# EAGLE design MBC5_1-3 (EAGLE 9.6.2)
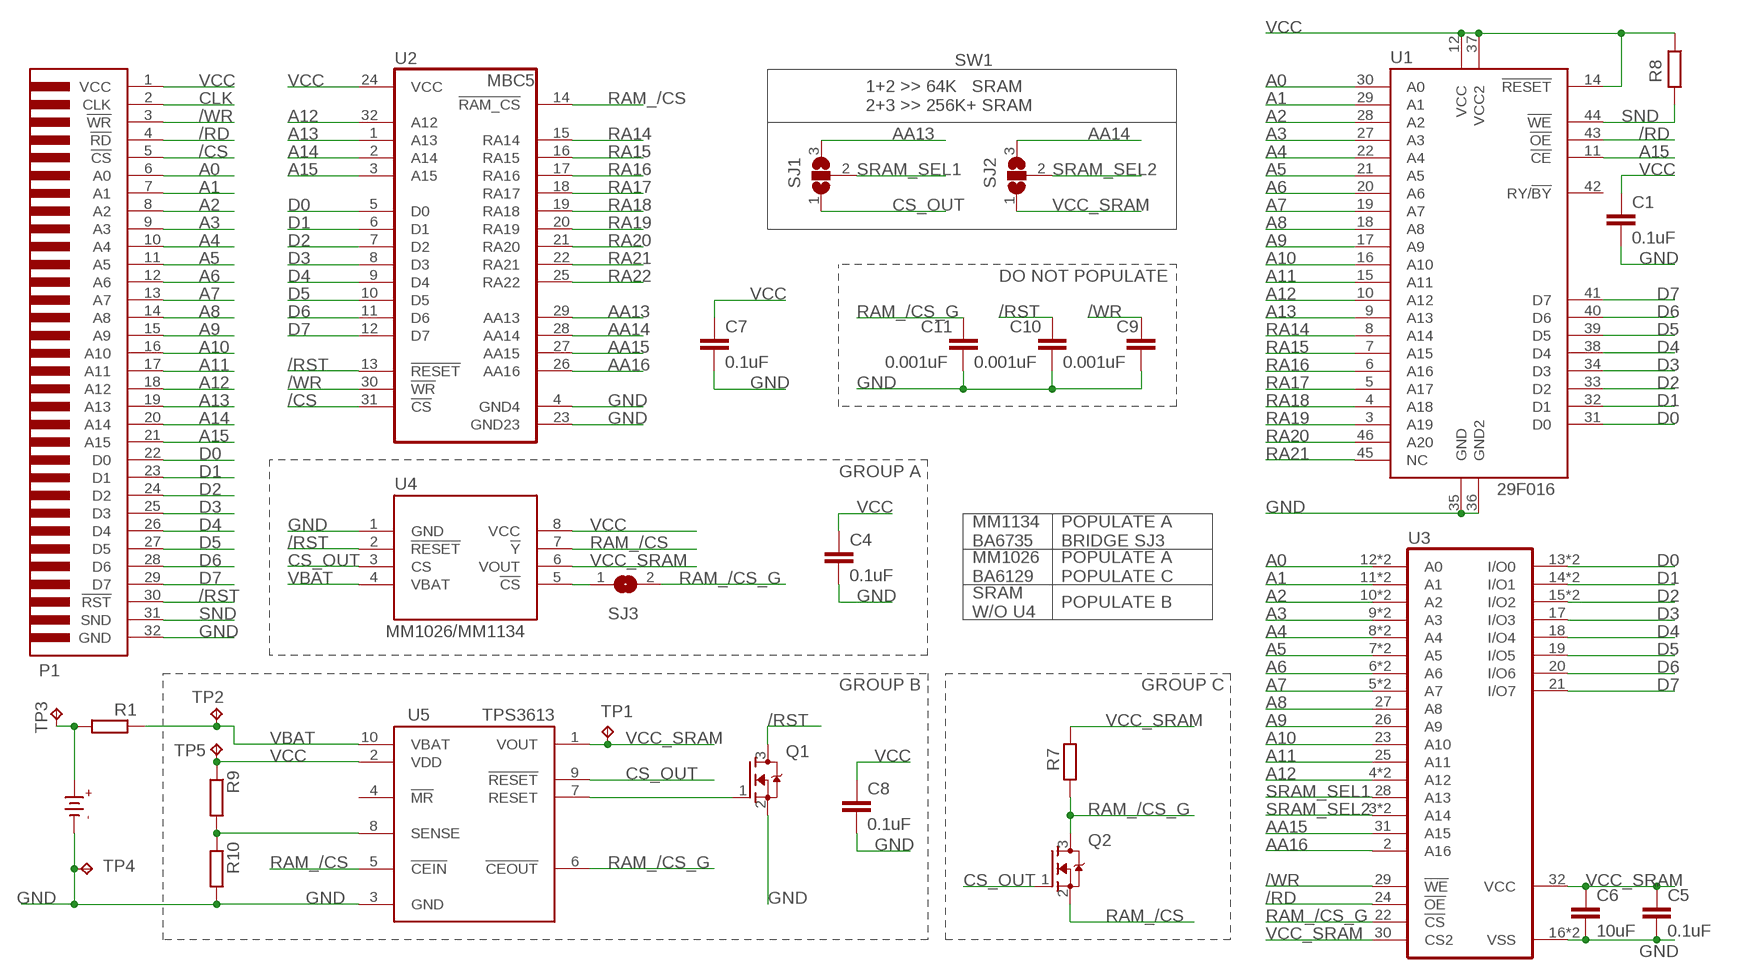
[diagram p0: schematic, sheet 1]

## Parts
B1  CR2025  [CR2025]
C1  0.1uF  C-EUC0603  [C0603]
C4  0.1uF  C-EUC0603  [C0603]
C5  0.1uF  C-EUC0603  [C0603]
C6  10uF  C-EUC0603  [C0603]
C7  0.1uF  C-EUC0603  [C0603]
C8  0.1uF  C-EUC0603  [C0603]
C9  0.001uF  C-EUC0603  [C0603]
C10  0.001uF  C-EUC0603  [C0603]
C11  0.001uF  C-EUC0603  [C0603]
P1  GBC_CART  [GBC_CART]
Q1  2N7002  MOSFET-NREFLOW  [SOT23]
Q2  2N7002  MOSFET-NREFLOW  [SOT23]
R1  RR0603  [R0603]
R7  RR0603  [R0603]
R8  RR0603  [R0603]
R9  RR0603  [R0603]
R10  RR0603  [R0603]
SJ1  SJ2W  [SJ_2]
SJ2  SJ2W  [SJ_2]
SJ3  SJ  [SJ]
TP1  TPB1,27  [B1,27]
TP2  TPB1,27  [B1,27]
TP3  TPB1,27  [B1,27]
TP4  TPB1,27  [B1,27]
TP5  TPB1,27  [B1,27]
U1  29F016  [TSOP-48]
U2  MBC5  [QFP-32]
U3  1008L  [SO32L_L]
U4  MM1134  [SOIC-8]
U5  TPS3613  [MSOP-10]

## Nets
/CS: P1.5(!CS) U2.31(!CS)
/RD: P1.4(!RD) U1.43(!OE) U3.24(!OE)
/RST: C10.1 P1.30(!RST) Q1.3(D) U2.13(!RESET) U4.2(!RESET)
/WR: C9.1 P1.3(!WR) U2.30(!WR) U3.29(!WE)
A0: P1.6(A0) U1.30(A0) U3.12(A0) U3.L12(A0)
A1: P1.7(A1) U1.29(A1) U3.11(A1) U3.L11(A1)
A2: P1.8(A2) U1.28(A2) U3.10(A2) U3.L10(A2)
A3: P1.9(A3) U1.27(A3) U3.9(A3) U3.L9(A3)
A4: P1.10(A4) U1.22(A4) U3.8(A4) U3.L8(A4)
A5: P1.11(A5) U1.21(A5) U3.7(A5) U3.L7(A5)
A6: P1.12(A6) U1.20(A6) U3.6(A6) U3.L6(A6)
A7: P1.13(A7) U1.19(A7) U3.5(A7) U3.L5(A7)
A8: P1.14(A8) U1.18(A8) U3.27(A8)
A9: P1.15(A9) U1.17(A9) U3.26(A9)
A10: P1.16(A10) U1.16(A10) U3.23(A10)
A11: P1.17(A11) U1.15(A11) U3.25(A11)
A12: P1.18(A12) U1.10(A12) U2.32(A12) U3.4(A12) U3.L4(A12)
A13: P1.19(A13) U1.9(A13) U2.1(A13)
A14: P1.20(A14) U2.2(A14)
A15: P1.21(A15) U1.11(!CE) U2.3(A15)
AA13: SJ1.3 U2.29(AA13)
AA14: SJ2.3 U2.28(AA14)
AA15: U2.27(AA15) U3.31(A15)
AA16: U2.26(AA16) U3.2(A16)
CLK: P1.2(CLK)
CS_OUT: Q2.1(G) SJ1.1 U4.3(CS) U5.9(!RESET)
D0: P1.22(D0) U1.31(D0) U2.5(D0) U3.13(I/O0) U3.L13(I/O0)
D1: P1.23(D1) U1.32(D1) U2.6(D1) U3.14(I/O1) U3.L14(I/O1)
D2: P1.24(D2) U1.33(D2) U2.7(D2) U3.15(I/O2) U3.L15(I/O2)
D3: P1.25(D3) U1.34(D3) U2.8(D3) U3.17(I/O3)
D4: P1.26(D4) U1.38(D4) U2.9(D4) U3.18(I/O4)
D5: P1.27(D5) U1.39(D5) U2.10(D5) U3.19(I/O5)
D6: P1.28(D6) U1.40(D6) U2.11(D6) U3.20(I/O6)
D7: P1.29(D7) U1.41(D7) U2.12(D7) U3.21(I/O7)
GND [GND]: B1.- C1.2 C4.2 C5.2 C6.2 C7.2 C8.2 C9.2 C10.2 C11.2 P1.32(GND) Q1.2(S) R10.2 TP4.TP U1.35(GND) U1.36(GND2) U2.4(GND4) U2.23(GND23) U3.16(VSS) U3.L16(VSS) U4.1(GND) U5.3(GND)
N$3 [VCC]: B1.+ R1.2 TP3.TP
N$4: SJ3.1 U4.5(!CS)
N$6: Q1.1(G) U5.7(RESET)
N$7: R9.2 R10.1 U5.8(SENSE)
RA14: U1.8(A14) U2.15(RA14)
RA15: U1.7(A15) U2.16(RA15)
RA16: U1.6(A16) U2.17(RA16)
RA17: U1.5(A17) U2.18(RA17)
RA18: U1.4(A18) U2.19(RA18)
RA19: U1.3(A19) U2.20(RA19)
RA20: U1.46(A20) U2.21(RA20)
RA21: U1.45(NC) U2.22(RA21)
RA22: U2.25(RA22)
RAM_/CS: Q2.2(S) U2.14(!RAM_CS) U4.7(!Y) U5.5(!CEIN)
RAM_/CS_G: C11.1 Q2.3(D) R7.1 SJ3.2 U3.22(!CS) U5.6(!CEOUT)
SND: P1.31(SND) R8.2 U1.44(!WE)
SRAM_SEL1: SJ1.2 U3.28(A13)
SRAM_SEL2: SJ2.2 U3.3(A14) U3.L3(A14)
VBAT [VCC]: R1.1 TP2.TP U4.4(VBAT) U5.10(VBAT)
VCC [VCC]: C1.1 C4.1 C7.1 C8.1 P1.1(VCC) R8.1 R9.1 TP5.TP U1.12(VCC) U1.14(!RESET) U1.37(VCC2) U2.24(VCC) U4.8(VCC) U5.2(VDD)
VCC_SRAM [VCC]: C5.1 C6.1 R7.2 SJ2.1 TP1.TP U3.30(CS2) U3.32(VCC) U4.6(VOUT) U5.1(VOUT)
Unconnected: U1.42(RY/!BY) U5.4(!MR)

## Notes on the sheet
- SW1
- 1+2 >> 64K   SRAM
  2+3 >> 256K+ SRAM
- DO NOT POPULATE
- GROUP A
- MM1134
  BA6735
- POPULATE A
  BRIDGE SJ3
- MM1026
  BA6129
- POPULATE A
  POPULATE C
- SRAM
  W/O U4
- POPULATE B
- MM1026/MM1134
- GROUP B | GROUP C

## Library data of the parts
B1 = gameboylib:CR2025
C1 C4-C11 = rcl:C-EU: CAPACITOR, European symbol; SPICEPREFIX: C
P1 = gameboylib:GBC_CART
Q1 Q2 = adafruit:MOSFET-N: N-Channel Mosfet 2N7002E - 60V 260mA SOT23 [Digikey: 2N7002ET1GOSTR-ND] - REEL BSH103 - 30V 850mA SOT23 [Digikey: 568-5013-1-ND]
R1 R7-R10 = eagle-ltspice:R: RESISTOR, European symbol; SPICEMODEL: NONE; SPICEPREFIX: R
SJ1 SJ2 = jumper:SJ2W: SMD solder JUMPER
SJ3 = jumper:SJ: SMD solder JUMPER
TP1-TP5 = testpad:TP: Test pad
U1 = gameboylib:29F016
U2 = gameboylib:MBC5: MBC5; OC_FARNELL: unknown; OC_NEWARK: unknown
U3 = gameboylib:1008L: MEMORY
U4 = gameboylib:MM1134
U5 = gameboylib:TPS3613

## Net classes
1 VCC: width 0.203 mm
2 GND: width 0.203 mm

## Board
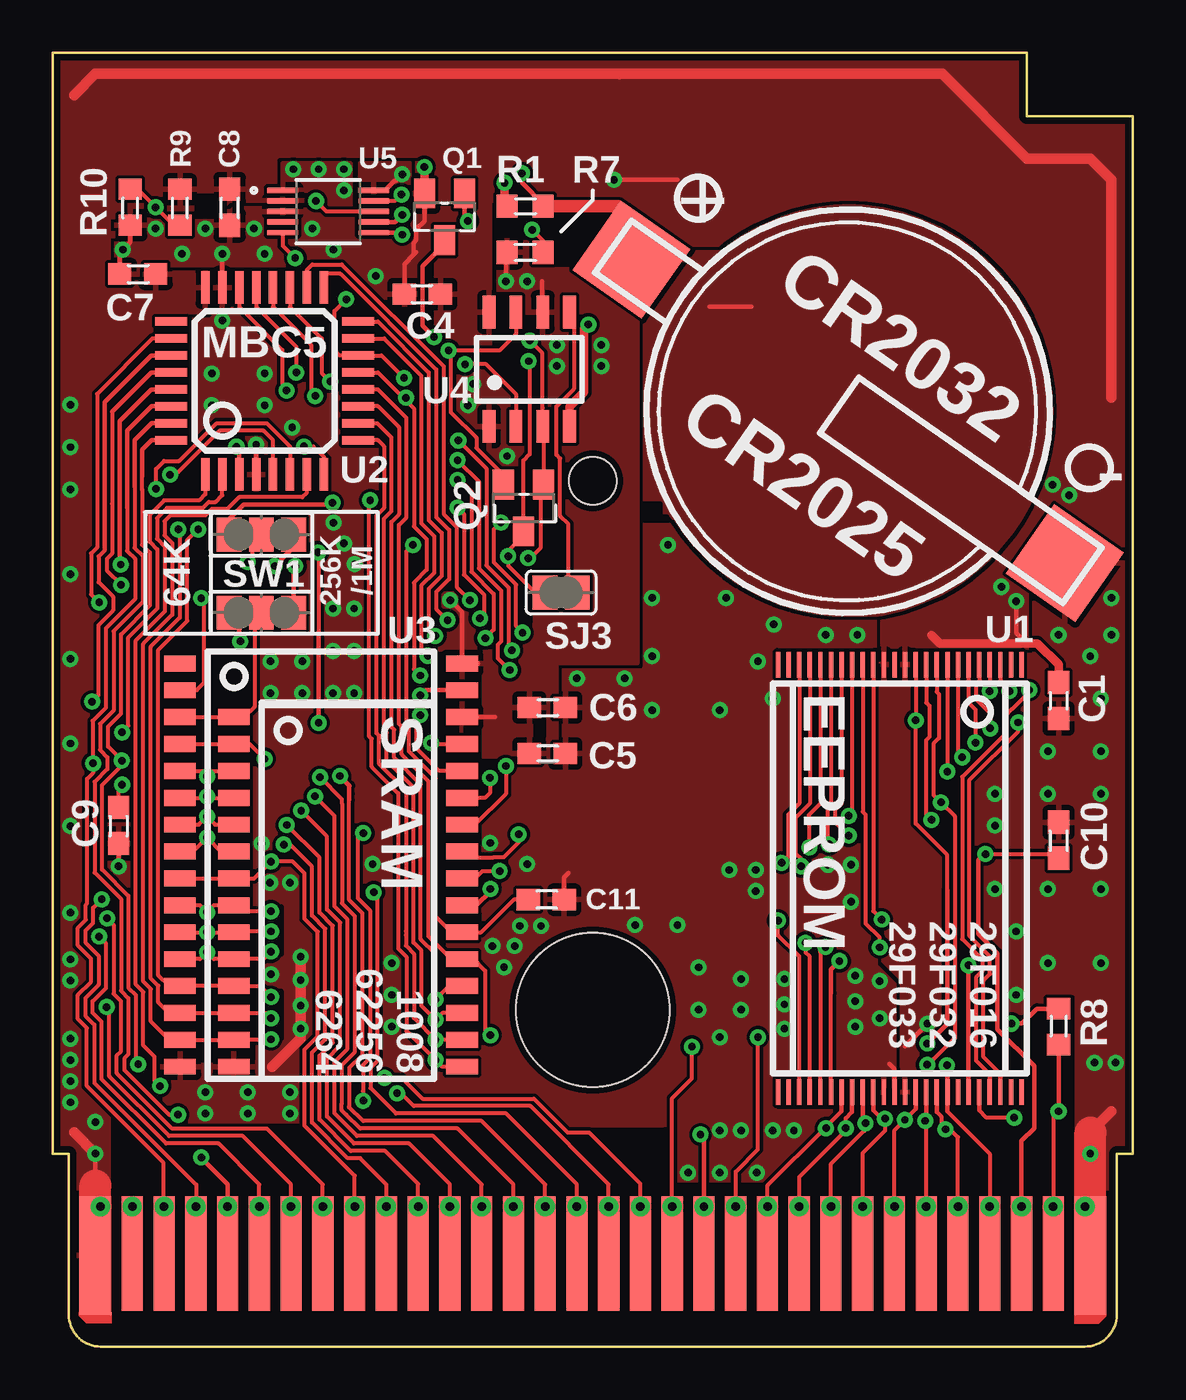
[diagram p1: board, top side]
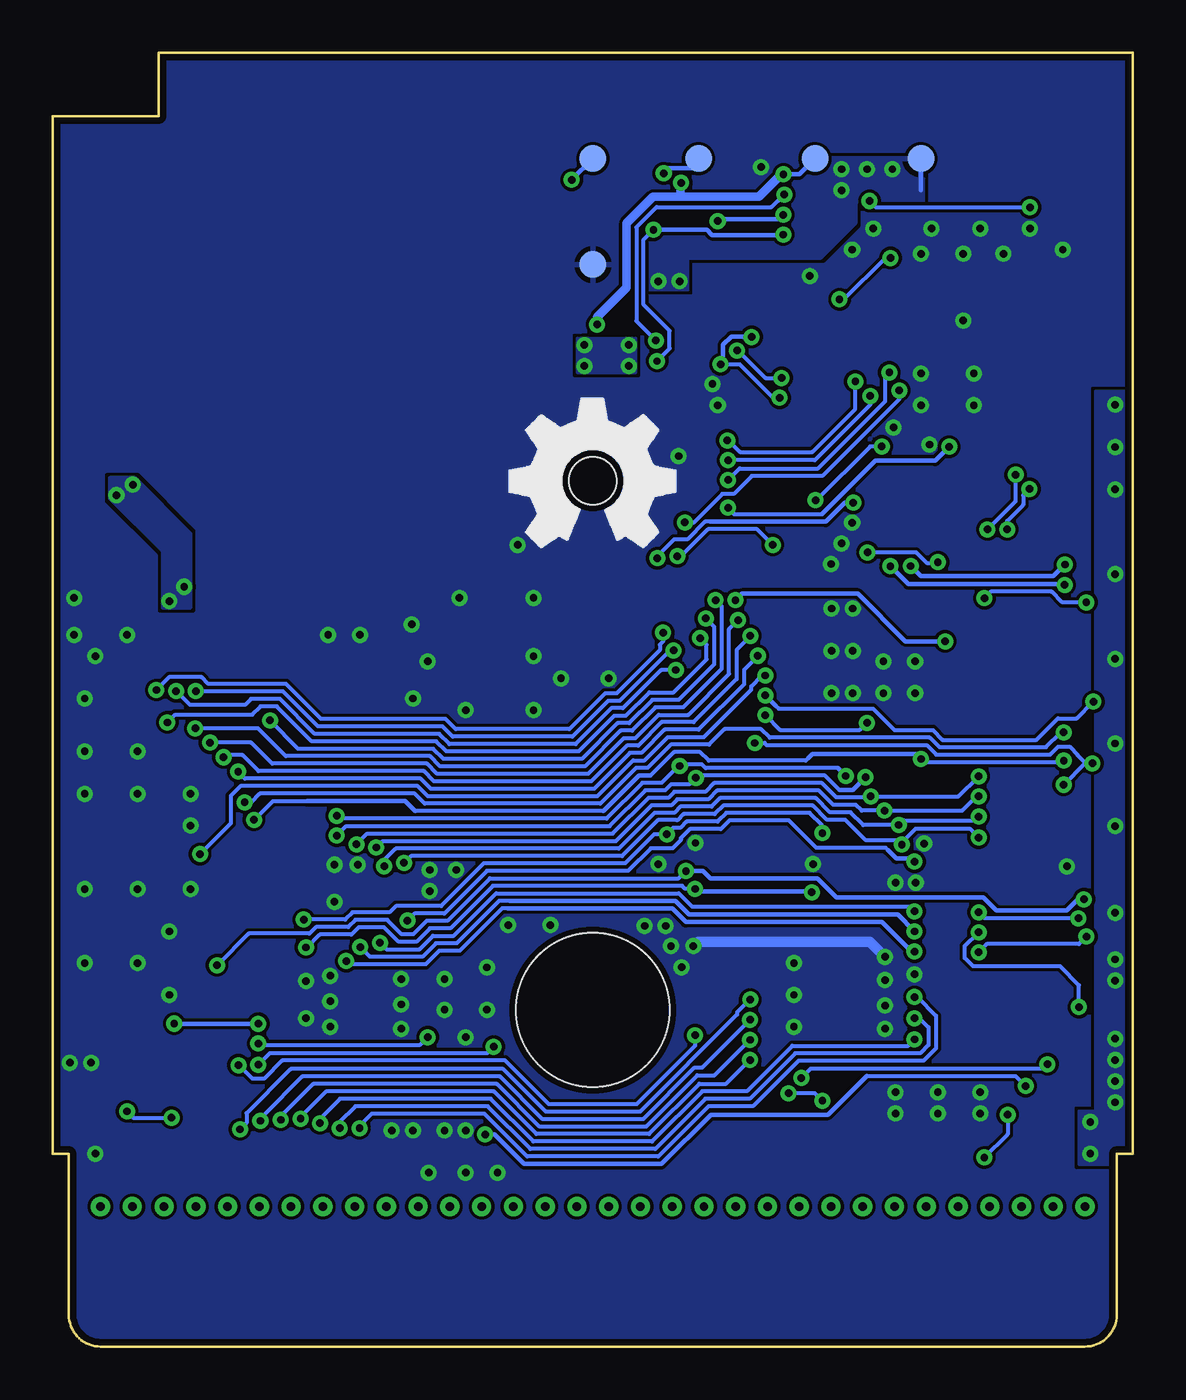
[diagram p2: board, bottom side, seen from below]

Size 51 x 61.1 mm. Coordinates in mm from the lower left corner, seen from the top.
Copper layers (1*16): Top 0.035mm / dielectric 1.5mm / Bottom 0.035mm
Design rules "default *": minimum track width 7mil, minimum drill 13mil, track to track 6mil, track to pad 7mil, pad to pad 7mil, via to via 7mil, smd to smd 5mil, copper to edge 12mil, drill to drill 22mil, minimum pad ring 10mil, minimum via ring 8mil, stop-mask expansion 4mil, vias tented up to drill 14mil, thermal gap 10mil
tKeepout: area -1.8,-1.5 to 54,11.6; area -1,11.1 to 2,62.1; area 49,11.1 to 52,62.1; area 2,55.2 to 49,62.1
tRestrict: area 28,6.8 to 33.9,7.7; area 2.9,3.6 to 48.1,7.7; area 10.2,14.5 to 10.8,16.8; area 34.1,12 to 39,12.7; area 34.2,32.6 to 38.8,32.9; area 46.6,0.8 to 49.9,1.3; area 40.7,32.6 to 45.8,32.9; area 8.3,50.5 to 11.7,50.9; area 6,43 to 6.5,48.5; area 8.9,21.1 to 9.3,29.5; area 9.1,13.6 to 9.4,14.3; area 7,13.5 to 7.6,13.9; area 18.4,29.1 to 18.9,32.6; area 19.8,30.3 to 20.1,31.9; area 19.5,23.7 to 20.1,29.3; area 19.8,19.9 to 20.1,20.5; area 21,49.3 to 22.1,49.7; area 34.2,11.3 to 43,11.8; area 47.5,4.7 to 48.1,16.5; area 27.9,39 to 29.1,39.8; area 2.9,7.1 to 3.5,11.2; area 25.1,9.8 to 28.9,10.3; area 23.6,51.1 to 24.7,51.5; area 21.8,48.2 to 22.9,48.6; area 10.2,10 to 11.8,10.4; area 10.2,18.5 to 10.8,20.8; area 9,17.3 to 9.6,18; area 21.2,52.5 to 21.6,52.9; area 6.8,53.4 to 7.6,54.4; area 16.4,48.6 to 16.9,49; area 22.1,34.2 to 22.6,34.6; area 22.8,28.8 to 23.2,29.5; area 15.9,54.5 to 16.1,54.6; area 39.5,11.9 to 39.5,12.2

### Footprints (pad centres in the part's own frame; a part is rotated, then mirrored left to right if it is on the bottom)
CR2025 = smd 4 x 4: + -12,0; - 13,0
C0603 = smd 1.1 x 1: 1 -0.85,0; 2 0.85,0
GBC_CART = smd 1.5 x 5.6: 1 -23.4,-25.01; 32 23.6,-25.01 | smd 1 x 5.4: 2 -21.65,-24.91; 3 -20.15,-24.91; 4 -18.65,-24.91; 5 -17.15,-24.91; 6 -15.65,-24.91; 7 -14.15,-24.91; 8 -12.65,-24.91; 9 -11.15,-24.91; 10 -9.65,-24.91; 11 -8.15,-24.91; 12 -6.65,-24.91; 13 -5.15,-24.91; 14 -3.65,-24.91; 15 -2.15,-24.91; 16 -0.65,-24.91; 17 0.85,-24.91; 18 2.35,-24.91; 19 3.85,-24.91; 20 5.35,-24.91; 21 6.85,-24.91; 22 8.35,-24.91; 23 9.85,-24.91; 24 11.35,-24.91; 25 12.85,-24.91; 26 14.35,-24.91; 27 15.85,-24.91; 28 17.35,-24.91; 29 18.85,-24.91; 30 20.35,-24.91; 31 21.85,-24.91 | drill 0.4: P$1 -21.65,-22.7; P$2 -18.65,-22.7; P$3 -15.65,-22.7; P$4 -12.65,-22.7; P$5 -9.65,-22.7; P$6 -6.65,-22.7; P$7 -3.65,-22.7; P$8 -0.65,-22.7; P$9 2.35,-22.7; P$10 5.35,-22.7; P$11 8.35,-22.7; P$12 11.35,-22.7; P$13 14.35,-22.7; P$14 17.35,-22.7; P$15 20.35,-22.7; P$16 23.35,-22.7; P$17 21.85,-22.7; P$18 18.85,-22.7; P$19 15.85,-22.7; P$20 12.85,-22.7; P$21 9.85,-22.7; P$22 6.85,-22.7; P$23 3.85,-22.7; P$24 0.85,-22.7; P$25 -2.15,-22.7; P$26 -5.15,-22.7; P$27 -8.15,-22.7; P$28 -11.15,-22.7; P$29 -14.15,-22.7; P$30 -17.15,-22.7; P$31 -20.15,-22.7; P$32 -23.15,-22.7 | hole 7.25: 0.1,-13.41 | hole 2.25: 0.1,11.585
SOT23 = smd 1 x 1.4: 1 -0.95,-1.1; 2 0.95,-1.1; 3 0,1.1
R0603 = smd 1 x 1.1: 1 -0.85,0; 2 0.85,0
SJ_2 = smd 1.168 x 1.6: 1 -1.524,0; 2 0,0; 3 1.524,0
SJ = smd 1.168 x 1.6: 1 -0.762,0; 2 0.762,0
B1,27 = smd 1.27 x 1.27: TP 0,0
TSOP-48 = smd 1.2 x 0.21: 1 -10.1,5.75; 2 -10.1,5.25; 3 -10.1,4.75; 4 -10.1,4.25; 5 -10.1,3.75; 6 -10.1,3.25; 7 -10.1,2.75; 8 -10.1,2.25; 9 -10.1,1.75; 10 -10.1,1.25; 11 -10.1,0.75; 12 -10.1,0.25; 13 -10.1,-0.25; 14 -10.1,-0.75; 15 -10.1,-1.25; 16 -10.1,-1.75; 17 -10.1,-2.25; 18 -10.1,-2.75; 19 -10.1,-3.25; 20 -10.1,-3.75; 21 -10.1,-4.25; 22 -10.1,-4.75; 23 -10.1,-5.25; 24 -10.1,-5.75; 25 10.1,-5.75; 26 10.1,-5.25; 27 10.1,-4.75; 28 10.1,-4.25; 29 10.1,-3.75; 30 10.1,-3.25; 31 10.1,-2.75; 32 10.1,-2.25; 33 10.1,-1.75; 34 10.1,-1.25; 35 10.1,-0.75; 36 10.1,-0.25; 37 10.1,0.25; 38 10.1,0.75; 39 10.1,1.25; 40 10.1,1.75; 41 10.1,2.25; 42 10.1,2.75; 43 10.1,3.25; 44 10.1,3.75; 45 10.1,4.25; 46 10.1,4.75; 47 10.1,5.25; 48 10.1,5.75
QFP-32 = smd 0.4 x 1.524: 1 -2.8,-4.415; 2 -2,-4.415; 3 -1.2,-4.415; 4 -0.4,-4.415; 5 0.4,-4.415; 6 1.2,-4.415; 7 2,-4.415; 8 2.8,-4.415; 17 2.8,4.415; 18 2,4.415; 19 1.2,4.415; 20 0.4,4.415; 21 -0.4,4.415; 22 -1.2,4.415; 23 -2,4.415; 24 -2.8,4.415 | smd 1.524 x 0.4: 9 4.415,-2.8; 10 4.415,-2; 11 4.415,-1.2; 12 4.415,-0.4; 13 4.415,0.4; 14 4.415,1.2; 15 4.415,2; 16 4.415,2.8; 25 -4.415,2.8; 26 -4.415,2; 27 -4.415,1.2; 28 -4.415,0.4; 29 -4.415,-0.4; 30 -4.415,-1.2; 31 -4.415,-2; 32 -4.415,-2.8
SO32L_L = smd 0.75 x 1.5: 1 -10.16,-7.997; 2 -8.89,-7.997; 3 -7.62,-5.457; 4 -6.35,-5.457; 5 -5.08,-5.457; 6 -3.81,-5.457; 7 -2.54,-5.457; 8 -1.27,-5.457; 9 0,-5.457; 10 1.27,-5.457; 11 2.54,-5.457; 12 3.81,-5.457; 13 5.08,-5.457; 14 6.35,-5.457; 15 7.62,-5.457; 16 8.89,-5.457; 17 8.89,5.33; 18 7.62,5.33; 19 6.35,5.33; 20 5.08,5.33; 21 3.81,5.33; 22 2.54,5.33; 23 1.27,5.33; 24 0,5.33; 25 -1.27,5.33; 26 -2.54,5.33; 27 -3.81,5.33; 28 -5.08,5.33; 29 -6.35,5.33; 30 -7.62,5.33; 31 -8.89,5.33; 32 -10.16,5.33; L3 -7.62,-7.997; L4 -6.35,-7.997; L5 -5.08,-7.997; L6 -3.81,-7.997; L7 -2.54,-7.997; L8 -1.27,-7.997; L9 0,-7.997; L10 1.27,-7.997; L11 2.54,-7.997; L12 3.81,-7.997; L13 5.08,-7.997; L14 6.35,-7.997; L15 7.62,-7.997; L16 8.89,-7.997
SOIC-8 = smd 0.6 x 1.55: 1 1.905,2.7; 2 0.635,2.7; 3 -0.635,2.7; 4 -1.905,2.7; 5 -1.905,-2.7; 6 -0.635,-2.7; 7 0.635,-2.7; 8 1.905,-2.7
MSOP-10 = smd 1.47 x 0.28: 1 -2.15,1; 2 -2.15,0.5; 3 -2.15,0; 4 -2.15,-0.5; 5 -2.15,-1; 6 2.15,-1; 7 2.15,-0.5; 8 2.15,0; 9 2.15,0.5; 10 2.15,1

### Placement (x,y rotation side)
B1  37.15,44.46 325 top
C1  47.5,30.51 270 top
C4  17.45,49.71 180 top
C5  23.35,28.01 0 top
C6  23.35,30.18 0 top
C7  4,50.66 180 top
C8  8.35,53.81 270 top
C9  3.1,24.61 270 top
C10  47.5,23.91 90 top
C11  23.3,21.11 0 top
P1  25.4,29.31 0 top
Q1  18.5,53.36 180 top
Q2  22.23,39.61 180 top
R1  22.3,53.86 0 top
R7  22.3,51.69 180 top
R8  47.5,15.11 270 top
R9  6,53.81 270 top
R10  3.65,53.81 270 top
SJ1  9.85,38.36 0 top
SJ2  9.85,34.66 0 top
SJ3  24,35.61 180 top
TP1  10,56.11 0 bottom
TP2  15,56.11 0 bottom
TP3  20.5,56.11 0 bottom
TP4  25.5,51.11 0 bottom
TP5  25.5,56.11 0 bottom
U1  40,22.11 270 top
U2  10,45.61 0 top
U3  14,22.11 270 top
U4  22.5,46.16 180 top
U5  13,53.61 0 top

### Tracks (layer width: path | path; a pad name or v marks a point on that pad's centre or on a via)
/CS  (via drill 0.35)
  Top 0.2: 3.86,40.61 3.86,37.73 4.23,37.36 4.23,35.16 2.86,33.79 2.86,30.04 2.23,29.41 2.23,28.18 2.58,27.84 2.58,27.28 1.97,26.67 1.97,22.39 3.21,21.15 3.21,16.8 3.57,16.45 3.57,13.8 3.37,13.61 3.37,13.06 5.48,10.95 v5.91,10.95
  Top 0.203: U2.31 4.66,43.61 3.86,42.81 3.86,40.61 | P1.5 8.25,7.66 7.01,8.9 v7.01,8.93
  Bottom 0.2: v7.01,8.93 5.91,10.03 v5.91,10.95
/RD  (via drill 0.35)
  Top 0.2: U3.24 19.95,22.11 20.3,22.46 v21.1,22.46 | 6.78,7.66 6.78,7.63 | 6.78,7.63 6.78,4.12 P1.4 | v2.31,21.13 1.9,20.72 1.9,20.01 1.53,19.64 1.53,19.09 2.16,18.46 2.16,17.09 1.53,16.46 1.53,15.62 1.95,15.2 1.95,12.46 6.78,7.63
  Top 0.203: U1.43 43.25,13.36 43.25,17.58 v43.25,18.01
  Bottom 0.2: 21.05,22.51 v21.1,22.46 | v21.1,22.46 21.07,22.43 | v21.1,22.46 21.45,22.11 30.36,22.11 32.37,20.11 33.34,20.11 33.98,19.47 34.52,19.47 35.21,20.16 36.7,20.16 37.05,19.81 38.57,19.81 38.88,19.51 41.75,19.51 v43.25,18.01
  Bottom 0.203: v2.31,21.13 2.59,21.13 3.1,20.61 6.44,20.61 7.05,21.22 13.99,21.22 14.88,22.11 19.95,22.11 20.3,22.46 21.05,22.46 21.07,22.43
/RST  (via drill 0.35)
  Top 0.2: U2.13 15.35,46.01 16.55,44.81 | 16.55,44.81 17.05,44.31 17.05,38.74 17.66,38.13 17.66,36.69 17.05,36.08 17.05,32 v17.35,31.69 | C10.1 47.5,23.26 v44.05,23.26 | 16.55,44.81 v16.68,44.81 | v19.47,46.39 20.47,46.39 21.86,44.99 U4.2
  Top 0.203: v44.05,23.26 43.98,23.26 43.71,22.98 43.71,19.48 44.62,18.58 44.62,14.98 46.35,13.25 46.35,10.31 45.75,9.71 P1.30 | Q1.3 18.5,52.06 17.47,51.03 17.47,48.21 v18,47.68
  Bottom 0.2: v17.35,31.69 17.5,31.69 | 17.5,31.69 17.55,31.69 | v44.05,23.26 42.6,24.71 42.6,26.01 42.14,26.47 33.77,26.47 33.29,25.99 25.29,25.99 23.6,27.68 23.06,27.68 21.96,28.78 20.25,28.78 18.01,31.03 18.01,31.19 17.5,31.69 | v19.47,46.39 18.57,46.39 16.98,44.81 v16.68,44.81
  Bottom 0.203: v18,47.68 18.39,47.68 18.42,47.71 18.96,47.71 19.35,47.32 19.35,46.51 v19.47,46.39
/WR  (via drill 0.35)
  Top 0.2: v17.85,28.51 17.9,28.46 U3.29 | 5.2,4.15 5.2,8.71 1.6,12.31 1.6,15.05 1.17,15.47 1.17,16.6 1.8,17.23 1.8,18.32 1.17,18.95 1.17,19.78 1.55,20.16 1.55,20.87 1.62,20.94 1.62,26.82 1.9,27.1 v1.9,27.55 1.88,27.58 1.88,29.55 2.51,30.18 2.51,33.93 3.88,35.3 3.88,37.21 3.51,37.58 3.51,39.61 | C9.1 3.1,26.38 v3.26,26.54
  Top 0.203: U2.30 4.66,44.41 3.51,43.26 3.51,39.61 | P1.3 5.2,4.15
  Bottom 0.2: 17.85,28.46 v17.85,28.51 17.39,28.51 17.29,28.41 9.73,28.41 9.28,27.96 3.9,27.96 3.52,28.33 2.98,28.33 2.59,27.95 2.59,27.92 2.23,27.56 | v3.26,26.54 2.23,27.56 | v1.9,27.55 2.22,27.55 2.23,27.56
A0  (via drill 0.35)
  Top 0.2: P1.6 9.75,7.66 7.82,9.59 5.34,9.59 2.3,12.63 2.3,15.34 1.88,15.77 1.88,16.31 2.51,16.94 2.51,19.04 v2.18,19.36 2.15,19.34 | v10.3,18.66 9.95,18.31 8.55,18.31 U3.12 7.6,18.3 v7.28,18.62 6.95,18.3 U3.L12 | U1.30 36.75,16.7
  Top 0.203: v37.15,18.21 36.75,17.81 36.75,16.7
  Bottom 0.2: v7.28,18.62 6.89,19.01 2.54,19.01 v2.18,19.36 | 29.5,20.7 29.78,20.7 31.78,18.7 32.76,18.7 33.4,18.06 37,18.06
  Bottom 0.203: v10.3,18.66 10.45,18.66 11.84,20.05 21.1,20.05 21.75,20.7 29.5,20.7 29.53,20.7 | 37,18.06 v37.15,18.21
A1  (via drill 0.35)
  Top 0.2: v10.3,19.61 8.83,19.61 U3.11 v7.28,19.57 U3.L11 | P1.7 11.25,7.66 8.97,9.94 5.49,9.94 2.67,12.76 2.67,15.91 v2.53,16.04 | v36.49,18.87 36.24,18.62 36.24,12.98 36.25,12.98 U1.29
  Bottom 0.2: v2.53,16.04 2.53,17.06 3.44,17.97 7.55,17.97 7.93,18.35 7.93,18.91 v7.28,19.57 | 29.43,21.06 29.9,21.06 | 29.9,21.06 29.91,21.05 29.92,21.05 | 29.9,21.06 29.92,21.06 31.93,19.05 32.91,19.05 33.54,18.41 36.03,18.41 v36.49,18.87
  Bottom 0.203: v10.3,19.61 11.1,20.41 20.95,20.41 21.6,21.06 29.43,21.06
A2  (via drill 0.35)
  Top 0.2: v10.3,20.56 8.82,20.56 U3.10 7.6,20.84 v7.28,20.52 6.95,20.84 U3.L10 | v35.55,19.07 35.55,18.62 35.75,18.43 U1.28 | P1.8 12.75,7.66 10.12,10.29 5.63,10.29 3.02,12.91 3.02,13.76 3.21,13.95 3.21,16.31 2.86,16.66 2.86,19.92 v2.56,20.23
  Bottom 0.2: v10.3,20.56 10.53,20.79 20.81,20.79 21.43,21.41 30.07,21.41 32.08,19.4 33.05,19.4 33.69,18.76 35.25,18.76 v35.55,19.07 | v2.56,20.23 6.99,20.23 v7.28,20.52
A3  (via drill 0.35)
  Top 0.2: P1.9 14.25,8.07 11.88,10.43 11.88,14.03 12.51,14.65 12.51,19.59 11.89,20.21 11.89,22.35 11.32,22.91 v10.3,22.91 9.5,22.11 U3.9 U3.L9 | v34.25,20.12 34.25,19.43 35.25,18.43 U1.27
  Bottom 0.2: 11.57,23.45 11.68,23.56 14.95,23.56 16.24,24.85 19.05,24.85 19.45,24.44 20.92,24.44 21.34,24.02 21.34,23.92 21.73,23.54 22.76,23.54 23.83,22.47 30.5,22.47 32.51,20.46 33.92,20.46 v34.25,20.12
  Bottom 0.203: v10.3,22.91 10.44,23.05 11.17,23.05 11.57,23.45
A4  (via drill 0.35)
  Top 0.2: P1.10 15.75,7.65 14.51,8.89 13.93,8.89 12.24,10.58 12.24,12.07 12.24,13.89 12.86,14.51 12.86,19.73 12.24,20.35 12.24,22.67 11.2,23.71 v10.9,23.71 | U3.8 7.93,23.38 v7.28,24.04 6.62,23.38 U3.L8 | v34.42,22.84 34.72,23.15 34.72,25.11 35.25,25.64 U1.22
  Bottom 0.2: v7.28,24.04 7.7,24.46 10.25,24.46 10.9,23.81 v10.9,23.71 11.1,23.91 12.6,23.91 13.57,24.88 14.44,24.88 15.11,25.56 19.34,25.56 19.75,25.15 21.21,25.15 21.5,24.85 21.53,24.85 21.54,24.86 22.43,24.86 24.12,23.17 34.09,23.17 v34.42,22.84
A5  (via drill 0.35)
  Top 0.2: P1.11 17.25,7.68 15.69,9.24 14.07,9.24 12.59,10.72 12.59,11.92 12.59,13.74 13.21,14.36 13.21,19.88 12.59,20.5 12.59,23.09 v11.05,24.63 | U3.7 7.66,24.65 v7.28,25.04 6.89,24.65 U3.L7 | v35.35,22.69 35.35,23.02 35.07,23.3 35.07,24.97 35.75,25.65 U1.21
  Bottom 0.2: v7.28,25.04 7.45,24.86 10.82,24.86 v11.05,24.63 12.72,24.63 13.32,25.23 14.29,25.23 14.96,25.91 19.48,25.91 19.89,25.5 21.36,25.5 21.64,25.21 22.58,25.21 24.27,23.52 34.81,23.52 35.35,22.99 v35.35,22.69
A6  (via drill 0.35)
  Top 0.2: P1.12 18.75,7.66 16.81,9.6 14.22,9.6 12.94,10.87 12.94,11.78 12.94,13.59 13.56,14.22 13.56,20.02 12.94,20.65 12.94,24.09 v11.72,25.31 | v7.28,25.98 7.28,25.92 | 7.28,25.92 U3.6 | v35.73,23.57 35.7,23.59 35.7,25.1 36.25,25.65 U1.20 | U3.L6 7.28,25.92
  Bottom 0.2: v7.28,25.98 7.38,25.98 8.05,25.31 v11.72,25.31 12.8,25.31 13.07,25.59 14.14,25.59 14.56,26 14.82,26.26 19.63,26.26 20.04,25.85 21.51,25.85 21.79,25.57 22.72,25.57 24.41,23.88 35.42,23.88 v35.73,23.57
A7  (via drill 0.35)
  Top 0.2: 7.43,27.19 7.28,27.04 v7.28,26.93 | 7.43,27.19 U3.5 | v12.38,25.98 13.29,25.06 13.29,20.79 13.92,20.17 13.92,14.07 13.29,13.45 13.29,11.63 13.29,11.02 14.36,9.95 17.96,9.95 20.25,7.66 P1.13 | v36.66,23.72 36.59,23.8 36.59,25.48 36.75,25.65 U1.19 | U3.L5 7.43,27.19
  Bottom 0.2: v12.38,25.98 8.22,25.98 v7.28,26.93 | v12.38,25.98 12.44,25.92 | v36.66,23.72 36.16,24.23 24.56,24.23 22.87,25.92 21.94,25.92 21.65,26.2 20.18,26.2 19.77,26.61 14.67,26.61 14.2,26.15 14.2,26.14 14,25.94 12.42,25.94 v12.38,25.98
A8  (via drill 0.35)
  Top 0.2: P1.14 21.75,7.66 19.11,10.3 14.51,10.3 13.86,10.96 13.85,10.96 13.65,11.16 13.65,11.48 13.65,11.49 13.65,13.3 14.27,13.92 14.27,20.31 13.65,20.94 13.65,25.66 13.65,25.86 v12.62,26.89 | v37.59,24.13 36.94,24.79 36.94,25.34 37.25,25.65 U1.18 | 19.55,26.14 U3.27 20.41,25.92 20.64,26.15 v20.64,26.86
  Bottom 0.2: v37.59,24.13 37.15,24.58 24.7,24.58 23.02,26.27 22.08,26.27 21.8,26.55 20.94,26.55 v20.64,26.86 20.53,26.97 14.53,26.97 13.85,26.29
  Bottom 0.203: 13.85,26.29 13.21,26.29 v12.62,26.89
A9  (via drill 0.35)
  Top 0.2: P1.15 23.25,7.66 20.26,10.65 14.66,10.65 14,11.31 | U3.26 19.94,24.65 21.39,26.1 v21.39,27.42 | 14,11.34 14,13.16 14.62,13.78 14.62,20.46 14,21.08 14,26.11 | v37.59,25.07 37.75,25.22 U1.17
  Top 0.203: 14,25.81 14,26.11 14,26.47 14.02,26.49 v13.55,26.95 | 14,11.31 14,11.34
  Bottom 0.2: v37.59,25.07 37.46,24.93 24.85,24.93 23.16,26.62 22.26,26.62 21.46,27.42 v21.39,27.42 21.3,27.52 20.36,27.52 20.17,27.32 13.92,27.32
  Bottom 0.203: 13.92,27.32 v13.55,26.95
A10  (via drill 0.35)
  Top 0.2: P1.16 24.75,7.66 21.41,11 16.2,11 15,12.21 15,13.16 15.34,13.49 15.34,21.27 v15.16,21.45 | U3.23 19.09,20.85 20.02,20.85 | v39.05,18.85 39.05,19.32 38.4,19.97 38.4,25.11 38.25,25.26 U1.16
  Top 0.203: v20.66,21.62 20.66,21.5 20.02,20.85
  Bottom 0.2: v20.66,21.62 21.14,21.62 21.29,21.76 30.21,21.76 32.22,19.75 33.2,19.75 33.83,19.12 34.67,19.12 35.36,19.8 36.56,19.8 36.9,19.46 38.39,19.46 39,18.85 v39.05,18.85
  Bottom 0.203: v15.16,21.45 15.2,21.5 20.55,21.5 v20.66,21.62
A11  (via drill 0.35)
  Top 0.2: P1.17 26.25,7.66 22.55,11.36 17.04,11.36 16.39,12 16.31,11.92 v16.26,11.97 | v14.66,24.25 14.4,24.25 14.4,21.18 14.97,20.61 14.97,13.63 14.65,13.3 14.65,12.06 14.66,12.06 v14.66,11.61 | v39.15,20.17 38.75,20.56 U1.15 | 22,24.09 v22,24.19 22,23.82 21.3,23.12 20.83,23.12 20.82,23.11 19.6,23.11 U3.25
  Top 0.203: 19.58,23.13 U3.25
  Bottom 0.2: v14.66,11.61 15.01,11.97 v16.26,11.97 | v14.66,24.25 14.66,24.6 15.26,25.2 19.19,25.2 19.6,24.79 21.07,24.79 21.36,24.5 21.69,24.5 | 21.68,24.51 21.69,24.5 | 21.69,24.5 v22,24.19 22.6,24.19 23.98,22.82 30.65,22.82 32.66,20.81 34.8,20.81 35.1,20.51 36.85,20.51 37.19,20.17 v39.15,20.17
A12  (via drill 0.35)
  Top 0.2: P1.18 27.75,7.68 25.32,10.11 24.32,10.11 22.72,11.71 17.46,11.71 16.48,12.69 v15.66,12.69 | v10,27.75 9.29,28.46 U3.4 U3.L4 | 4.22,41.11 4.22,40.46 4.21,40.46 4.21,37.87 4.58,37.5 4.58,35.01 3.21,33.64 3.21,29.89 2.61,29.28 2.61,28.34 3.25,27.7 v3.25,27.68 3.25,27.45 2.32,26.52 2.32,22.54 3.57,21.29 3.57,16.95 3.92,16.6 3.92,13.45 v4.03,13.34 | v41.5,24.88 41.24,25.13 41.24,28.63 41.41,28.79 41.41,30.26 41.25,30.42 U1.10
  Top 0.203: U2.32 4.67,42.81 4.22,42.36 4.22,41.11
  Bottom 0.2: v15.66,12.69 15.21,13.14 4.23,13.14 v4.03,13.34 | 10.23,27.98 v10,27.75 9.85,27.6 3.32,27.6 v3.25,27.68 | 25,25.29 33.88,25.29 | v41.5,24.88 40.61,25.77 39,25.77 | 15.25,27.86 15.44,27.67 20.02,27.67 20.43,28.08 21.67,28.08 22.77,26.98
  Bottom 0.203: 10.23,27.98 15.13,27.98 15.25,27.86 15.33,27.78 | 22.77,26.98 23.31,26.98 25,25.29 | 33.88,25.29 34.36,25.77 39,25.77
A13  (via drill 0.35)
  Top 0.2: P1.19 29.25,11.73 30.18,12.67 v30.18,14.17 | v41.3,13.31 41.33,13.31 42.49,14.47 42.56,14.55 | U2.1 7.2,40.26 6.9,39.96 5.25,39.96 4.57,39.28 4.57,38.02 4.93,37.65 4.93,34.86 3.57,33.49 3.57,29.32 v3.26,29.01 | 42.59,14.57 42.59,25.06 v41.94,25.71 41.59,26.06 41.59,28.48 41.85,28.74 41.85,30.82 41.75,30.92 U1.9
  Top 0.203: 42.59,14.57 42.56,14.55
  Bottom 0.2: v30.18,14.17 30.49,13.86 40.75,13.86 v41.3,13.31 | v41.94,25.71 41.64,25.71 41.23,26.12 33.92,26.12 33.44,25.64 25.14,25.64 23.45,27.33 22.91,27.33 21.81,28.43 20.01,28.43 19.27,29.17 17.55,29.17 17.14,28.76 9.58,28.76 9.13,28.31 4.09,28.31 3.39,29.01 v3.26,29.01
A14  (via drill 0.35)
  Top 0.178: 5.4,39.61 5.41,39.62 7.09,39.62 7.36,39.89 7.68,39.89 8,40.21
  Top 0.2: 8,40.21 U2.2 | 5.4,39.61 4.92,39.13 4.92,38.16 5.29,37.79 5.29,34.72 3.92,33.35 3.92,17.1 4.27,16.74 4.27,14.22 4.8,13.69 4.8,12.56 v5.06,12.31
  Top 0.203: P1.20 30.75,9.85 v30.59,10.01
  Bottom 0.2: 12.55,12.78 5.53,12.78 v5.06,12.31
  Bottom 0.203: 12.55,12.78 14.38,10.95 19.93,10.95 22.26,8.62 28.74,8.62 30.13,10.01 v30.59,10.01
A15  (via drill 0.35)
  Top 0.2: P1.21 32.25,8.26 33.3,9.31 v33.3,14.61 | v19.11,39.62 19.42,39.31 19.42,36.45 20.35,35.52 20.35,34.58 v20.17,34.4 v20.16,34.4 | 42.24,21.57 42.24,23.21 40.75,24.7 v40.75,29.58 U1.11
  Top 0.203: U2.3 8.8,42.37 v8.67,42.5 | v41.3,14.31 42.24,15.25 42.24,21.57
  Bottom 0.2: v41.3,14.31 41.3,14.26 33.65,14.26 v33.3,14.61 | v19.11,39.62 18.81,39.32 14.67,39.32 | v20.16,34.4 19.77,34 19.77,32.23 21.45,30.54 22.69,30.54 23.79,29.45 24.33,29.45 26.02,27.75 32.56,27.75 33.04,28.24 39.42,28.24 40.75,29.56 v40.75,29.58
  Bottom 0.203: 14.67,39.32 12.15,41.84 9.32,41.84 v8.67,42.5
AA13  (via drill 0.35)
  Top 0.203: v3.2,36.94 3.15,36.98 3.15,43.71 4.65,45.21 U2.29 | SJ1.3 11.37,37.76 v10.48,36.87
  Bottom 0.203: v3.2,36.94 3.75,36.38 10,36.38 v10.48,36.87
AA14  (via drill 0.35)
  Top 0.2: 11.36,34.67 SJ2.3 | 2.79,44.16 2.79,39.82 2.8,39.81 2.8,37.46 2.54,37.21 2.54,36.66 3.21,35.99 v3.21,35.97
  Top 0.203: SJ2.3 11.37,36.78 v11.44,36.85 | 2.79,44.16 4.65,46.01 U2.28
  Bottom 0.203: v11.44,36.85 10.6,36.01 3.25,36.01 v3.21,35.97
AA15  (via drill 0.35)
  Top 0.2: 2.44,37.73 2.44,37.6 2.16,37.32 2.16,36.1 2.84,35.42 2.84,34.77 2.16,34.08 2.16,30.76 2.15,30.76 v1.85,30.46
  Top 0.203: U2.27 4.64,46.81 2.44,44.6 2.44,37.73 | v17.35,30.76 17.59,31 U3.31
  Bottom 0.2: 16.85,30.26 16.72,30.13 12.26,30.13 11.25,29.11 9.44,29.11 8.98,28.66 4.54,28.66 3.53,29.67 2.64,29.67 v1.85,30.46
  Bottom 0.203: v17.35,30.76 16.85,30.26
AA16  (via drill 0.35)
  Top 0.2: U2.26 4.7,47.61 2.08,44.99 2.08,37.74 1.8,37.46 1.8,35.53 v2.19,35.14 | U3.2 6.79,31 7.13,31.34 7.13,35.22 v7,35.35
  Bottom 0.2: v2.19,35.14 3.31,35.14 3.82,35.65 6.7,35.65 v7,35.35
CS_OUT  (via drill 0.35)
  Top 0.2: U4.3 23.25,43.34 | U4.3 23.18,43.42 Q2.1 23.02,40.56 23.02,37.71 22.55,37.23 v22.45,37.23 | v16.46,54.41 16.16,54.11 U5.9 | U4.3 23.14,44.33 23.12,44.34 23.12,46.91 v22.52,47.51
  Top 0.203: SJ1.1 8.33,39.09 9.01,39.77 13.11,39.77 v13.2,39.86
  Bottom 0.2: v22.52,47.51 23.45,48.44 23.45,52.86 22.49,53.82 17.06,53.82 16.77,54.11 16.76,54.11 v16.46,54.41 | 19.95,38.96 20.2,38.96 21.03,38.12 21.66,38.12 22.45,37.34 v22.45,37.23
  Bottom 0.203: v13.2,39.86 13.6,39.86 14.5,38.96 19.95,38.96
D0  (via drill 0.35)
  Top 0.2: v10.3,16.51 9.78,17.03 U3.13 U3.L13 5.48,17.03 4.97,17.54 4.97,32.91 6.34,34.28 6.34,38.08 v6.86,38.6 | 33.75,5.15 P1.22 33.75,7.61 36.46,10.32 v36.52,10.32 36.52,10.38 37.25,11.11 | U2.5 10.4,42.81 9.95,43.26 7.89,43.26 5.8,41.18 v5.53,41.18
  Top 0.203: U3.13 7.95,17.03 | 37.25,11.11 U1.31
  Bottom 0.2: v10.3,16.51 10.17,16.51 9.29,15.63 9.29,14.09 9.88,13.5 15.78,13.5 17.94,11.35 20.03,11.35 22.4,8.98 28.6,8.98 30.61,11 35.94,11 36.52,10.42 v36.52,10.32 | v5.53,41.18 5.53,39.92 v6.86,38.6
D1  (via drill 0.35)
  Top 0.2: v10.3,15.51 10.05,15.76 U3.14 U3.L14 | 35.25,5.42 P1.23 35.25,8.01 37.45,10.21 v37.45,10.31 37.45,10.79 37.75,11.08 | v4.87,40.51 4.87,41.45 5.25,41.83 5.96,41.83 7.74,43.61 10.1,43.61 11.2,42.51 U2.6 | 37.75,11.31 37.75,11.11 | v5.93,38.6 5.99,38.53 5.99,34.42 4.62,33.06 4.62,17.39 4.97,17.04 4.97,16.26 5.47,15.76 U3.L14 | 5.5,15.76 U3.L14
  Top 0.203: U3.14 8.09,15.76 | U1.32 37.75,11.11 37.75,11.08
  Bottom 0.2: v10.3,15.51 10.07,15.51 9.64,15.08 9.64,14.24 10.03,13.85 15.93,13.85 18.08,11.7 20.18,11.7 22.55,9.33 28.45,9.33 30.47,11.35 36.71,11.35 37.45,10.61 v37.45,10.31 | v5.93,38.6 5.93,39 5.17,39.75 5.17,40.21 v4.87,40.51
D2  (via drill 0.35)
  Top 0.178: 8.81,40.12 8.79,40.12 8.22,39.56 7.5,39.56 7.2,39.26
  Top 0.2: v10.3,14.51 10.28,14.49 U3.15 U3.L15 | 7.2,39.26 5.54,39.26 5.27,38.98 5.27,38.31 5.64,37.94 5.64,34.57 4.27,33.2 4.27,17.24 4.62,16.89 4.62,15.36 5.5,14.49 U3.L15 | U2.7 12,40.34 11.78,40.12 8.81,40.12 | 38.25,10.69 v38.38,10.55 38.31,10.48 38.31,10.19 36.75,8.63 P1.24 | U3.L15 5.45,14.49
  Top 0.203: U3.15 7.92,14.49 | U1.33 38.25,10.69
  Bottom 0.2: v10.3,14.51 10.6,14.21 16.07,14.21 18.23,12.05 20.32,12.05 22.7,9.68 28.3,9.68 30.32,11.7 37.44,11.7 38.38,10.75 v38.38,10.55
D3  (via drill 0.35)
  Top 0.2: U3.17 18.39,13.22 v18.07,13.54 16.7,14.91 16.7,18.41 16.31,18.8 16.31,26.13 15.06,27.38 15.06,28.7 14.93,28.82 14.93,39.93 v14.98,39.98 | v11.86,42.51 12.3,42.51 12.8,42.01 U2.8 | P1.25 38.25,9.14 39.3,10.19 v39.3,10.76 39.15,10.76 38.75,11.16
  Top 0.203: U1.34 38.75,11.16
  Bottom 0.2: v18.07,13.54 19.2,12.41 20.47,12.41 22.84,10.04 28.16,10.04 30.18,12.05 38.1,12.05 39.3,10.85 v39.3,10.76 | v14.98,39.98 14.93,39.98 12.39,42.51 v11.86,42.51
D4  (via drill 0.35)
  Top 0.2: U3.18 v18.08,14.49 | v18.08,14.49 v18.07,14.48 | U2.9 15.35,42.81 15.64,42.52 15.64,39.6 15.29,39.24 15.29,28.97 15.41,28.84 15.41,27.53 16.67,26.27 16.67,19.61 | 16.67,19.61 16.67,19.44 | 40.75,11.22 v40.24,10.71 39.75,10.22 P1.26 | 16.67,19.61 16.67,18.94 17.06,18.56 17.06,15.51 v18.08,14.49
  Top 0.203: U1.38 40.75,11.22
  Bottom 0.2: v18.07,14.48 19.75,12.81 20.57,12.81 22.99,10.39 28.01,10.39 30.03,12.4 38.7,12.4 40.24,10.87 v40.24,10.71
D5  (via drill 0.35)
  Top 0.2: U3.19 18.4,15.76 v18.07,15.43 17.41,16.1 17.41,18.7 17.02,19.09 17.02,26.41 15.76,27.67 15.76,28.99 15.64,29.12 15.64,39.1 15.99,39.45 15.99,42.94 15.32,43.61 U2.10 | 41.25,10.71 v41.2,10.66 41.25,10.61 P1.27
  Top 0.203: U1.39 41.25,10.71
  Bottom 0.2: v18.07,15.43 20.32,13.18 20.69,13.18 23.13,10.74 27.87,10.74 29.88,12.76 39.23,12.76 41.05,10.93 41.05,10.81 v41.2,10.66
D6  (via drill 0.35)
  Top 0.2: U3.20 18.7,17.03 v18.06,16.39 18.06,18.55 17.38,19.24 17.38,26.56 16.12,27.82 16.12,29.14 15.99,29.26 15.99,38.95 16.34,39.3 16.34,43.42 15.35,44.41 U2.11 | 41.75,11.08 41.96,10.87 41.96,10.46 v42.16,10.26 42.36,10.27 42.75,9.88 P1.28
  Top 0.203: U1.40 41.75,11.08
  Bottom 0.2: v18.06,16.39 18.09,16.39 18.69,15.79 18.69,15.68 23.28,11.09 27.72,11.09 29.74,13.11 39.77,13.11 41.86,11.02 41.86,10.56 v42.16,10.26
D7  (via drill 0.35)
  Top 0.2: 44.23,5.02 44.25,5 P1.29 44.25,9.11 42.25,11.11 | v20.67,14.7 20.42,14.95 20.42,17.75 19.87,18.3 U3.21 18.81,18.3 17.73,19.38 17.73,26.71 16.47,27.96 16.47,29.28 16.34,29.41 16.34,38.8 16.7,39.16 16.7,43.86 15.35,45.21 U2.12 | 42.25,13.27 v42.23,13.29
  Top 0.203: 42.25,11.11 U1.41 42.25,13.27
  Bottom 0.2: v20.67,14.7 20.67,14.2 23.43,11.45 27.57,11.45 29.64,13.51 40.17,13.51 41.03,12.65 41.57,12.65 42.21,13.29 v42.23,13.29
GND  (via drill 0.35)
  Top 0.203: C9.2 v3.1,22.68 | U2.4 v9.6,42.6 | C7.2 3.15,51.66 v3.3,51.81 3.65,52.16 R10.2 | 8,52.51 7.95,52.56 C8.2 | C4.2 16.6,51.13 17.04,51.57 | C11.2 24.15,22.16 24.35,22.36 | 17.15,51.69 17.04,51.57 | Q1.2 17.55,53.16 17.16,52.77 17.16,52.24 17.04,52.12 17.04,51.57 | U2.23 v8,51.61 | U1.36 39.75,13.11 39.5,13.36
  Top 0.4: U4.1 20.5,43.55 | Q1.2 v17.55,55.71
  Top 0.5: 49,10.11 50,11.11 | v11.7,18.41 11.7,14.56 10.36,13.22
  Top 1.5: P1.32 49,10.11
  Bottom 0.203: 20.5,19.11 20.56,19.11 v20.76,18.92
  Bottom 0.5: v11.7,18.41 12.4,19.11 20.5,19.11
  other vias: 11.7,17.31 11.7,16.11 11.7,15.01 9.2,12.01 30.5,17.91 30.5,15.91 32.5,15.91 50.2,13.41 49,9.11 49.2,13.41 37.9,16.31 37.9,17.51 23.06,19.87 31.5,14.61 49.5,28.11 47,21.61 49.5,21.61 34,30.61 8,48.46 7.5,45.96 10,45.96 10,44.46 13.25,38.91 13.22,34.86 9.85,23.76 45.5,16.61 44.5,21.61 47,18.11 49.5,18.11 11.3,43.41 21.81,18.92 22.06,19.87 21.31,17.92 30,8.21 19.85,45.46 31.5,8.21 33.25,8.21 31.5,10.21 32.5,10.21 34,10.21 35,10.21 38,33.61 36.5,33.61 36.6,22.76 37.7,22.76 39.05,17.26 39.05,15.51 37.9,15.11 34.55,15.01 34.55,17.36 34.55,16.16 32.5,17.36 27.5,19.91 44.5,24.61 44.5,26.11 47,28.11 47,26.11 49.5,26.11 47.5,33.61 49,32.61 50,33.61 50,35.36 7.5,44.46 21.45,42.06 7.2,12.01 7.2,11.01 11.2,21.91 10.25,21.91 15.1,22.79 16,18.11 16,16.61 16,15.11 9.2,11.01 11.2,11.01 11.2,12.01 13.75,37.94 14.25,36.96 10.3,17.59 49.5,30.61 11.78,32.36 10.28,32.36 10.28,30.86 11.78,30.86 14.22,34.86 13.22,32.86 14.22,32.86 13.22,30.86 14.22,30.86 4.85,52.81 6.1,51.61 7.2,52.81 9.5,52.81 10,51.61 12.25,52.81 13.25,51.81 15.25,50.56 19.6,44.46 31.95,22.51 33.2,22.51 33.2,21.51 37.7,21.01 29.5,19.91 45.5,19.61 28.3,32.61 29.05,37.86 28.3,35.36 28.3,30.06 31.5,30.06 31.8,35.36 34.05,34.11 33.3,32.36 27,31.56 20.65,23.79 24.75,31.56 22.4,22.79
  pour Top (rank 6): -3,63.11 55.5,63.11 55.5,6.61 -5,6.61 -5,61.11
  pour Bottom (rank 6): -1.5,62.11 56,62.11 56,-2.39 -1,-2.39 -1,61.11 -1.5,61.61
  pour Top: 38.85,33.01 38.85,34.21 35.5,34.21 35.5,33.01
  pour Top (rank 2): 27.56,44.16 arc90 37.5,34.22 35.7,33.61 34.1,33.61 34.05,33.66 33.5,33.66 29.35,37.81 27.56,37.81
  pour Top: 3,50.61 3,53.66 9.55,53.66 9.5,53.61 9.5,51.06 4,51.06 4,50.61
N$3  (via drill 0.35)
  Top 0.203: R1.2 23.15,53.97 22.15,54.97 v22.15,55.42 | B1.+ 28.77,51.34 | 31,49.11 33,49.11
  Top 0.4: B1.+ 27.32,53.24
  Top 0.6: 27.32,53.24 26.7,53.86 R1.2
  Bottom 0.203: TP3.TP 20.5,55.67 21.9,55.67 v22.15,55.42
  pour Top (rank 4): 27.5,50.11 32,54.61 42,54.61 48,48.61 48,39.61 42.5,34.11 33.5,34.11 27.5,40.11
  pour Top (rank 2): 28.35,51.71 31.55,51.71 31.55,44.56 27.95,44.56 27.95,51.31
N$4
  Top 0.2: SJ3.1 24.35,36.02 24.35,38.84 23.95,39.23 23.95,41.94 23.78,42.12 23.78,44.4 24.61,45.23 24.61,48.66 U4.5
N$6  (via drill 0.35)
  Top 0.203: Q1.1 19.45,53.31 v19.6,53.16 | v16.5,53.45 16.16,53.11 U5.7
  Bottom 0.203: v19.6,53.16 19.51,53.25 16.7,53.25 v16.5,53.45
N$7  (via drill 0.35)
  Top 0.2: U5.8 12.93,53.61 v12.43,54.11 | R9.2 5.7,52.96 v4.85,53.81 4,54.66 R10.1
  Bottom 0.2: v12.43,54.11 12.12,53.81 v4.85,53.81
RA14  (via drill 0.35)
  Top 0.2: U2.15 15.65,47.61 17.4,45.86 17.4,38.88 18.01,38.28 18.01,36.54 17.4,35.94 17.4,32.93 v17.7,32.63 | v42.25,27.16 U1.8
  Bottom 0.2: v17.7,32.63 v17.7,32.62 18.36,31.96 18.36,31.27 20.5,29.13 22.1,29.13 23.2,28.04 23.75,28.04 25.44,26.34 33.14,26.34 33.63,26.83 41.94,26.83 42.25,27.14 v42.25,27.16
RA15  (via drill 0.35)
  Top 0.2: U2.16 15.35,48.41 17.75,46.01 17.75,39.03 18.36,38.42 18.36,36.4 17.75,35.79 17.75,33.87 v18.06,33.56 | 42.75,32.11 U1.7 42.75,28.03 v42.95,27.84 42.75,27.84
  Bottom 0.2: v18.06,33.56 v18.06,33.55 18.71,32.9 18.71,31.52 20.75,29.49 22.25,29.49 23.35,28.39 23.89,28.39 25.58,26.7 33,26.7 33.48,27.18 41.29,27.18 42.05,27.93 42.84,27.93 v42.95,27.84
RA16  (via drill 0.35)
  Top 0.2: U2.17 12.8,50.67 13.58,50.67 18.11,46.15 18.11,39.18 18.71,38.57 18.71,36.25 18.11,35.64 18.11,34.84 v18.64,34.31 | U1.6 43.24,31.61 43.24,30.42 43.58,30.08 v43.58,28.53
  Top 0.203: 43.25,32.11 U1.6 43.25,31.62 43.24,31.61
  Bottom 0.2: v18.64,34.31 19.07,33.89 19.07,31.77 20.99,29.84 22.4,29.84 23.5,28.74 24.04,28.74 25.73,27.05 32.85,27.05 33.33,27.53 40.65,27.53 41.64,28.53 v43.58,28.53
RA17  (via drill 0.35)
  Top 0.2: U2.18 12,50.86 12.25,51.11 13.65,51.11 18.46,46.3 18.46,39.32 19.07,38.72 19.07,35.88 v19.7,35.25 | v44.27,29.2 44.27,29.91 43.59,30.59 43.59,31.23 43.75,31.39 U1.5
  Bottom 0.2: v19.7,35.25 19.42,34.97 19.42,32.01 21.24,30.19 22.54,30.19 23.64,29.09 24.18,29.09 25.88,27.4 32.71,27.4 33.19,27.88 40,27.88 41.31,29.2 v44.27,29.2
RA18  (via drill 0.35)
  Top 0.2: U2.19 11.2,49.1 12.69,47.61 12.69,45.98 v13.1,45.58 | v19.15,42.8 20.48,41.47 20.48,36.89 21.52,35.84 21.52,33.04 v21.68,32.88 | U1.4 v44.25,30.96
  Bottom 0.2: v13.1,45.58 13.1,44.28 15.13,42.25 18.55,42.25 19.1,42.8 v19.15,42.8 | v21.68,32.88 21.68,32.86 | 21.68,32.86 21.68,32.84 | v44.25,30.96 44.23,30.94 40.13,30.94 38.48,29.29 32.6,29.29 32.12,28.81 26.46,28.81 24.77,30.5 24.23,30.5 21.87,32.86 21.68,32.86
RA19  (via drill 0.35)
  Top 0.2: U2.20 10.4,49.11 12.2,47.31 12.2,45.09 v12.39,44.89 | v19.11,41.86 20.12,40.85 20.12,36.75 21.17,35.7 21.17,33.31 21.01,33.14 21.01,32.52 v21.58,31.95 | v45.18,30.96 44.75,31.39 U1.3
  Bottom 0.2: v12.39,44.89 12.39,44.49 15.02,41.86 v19.11,41.86 | v45.18,30.96 44.52,30.3 41.93,30.3 41.64,30.59 40.28,30.59 38.63,28.94 32.75,28.94 32.27,28.46 26.31,28.46 24.62,30.15 24.08,30.15 22.28,31.95 v21.58,31.95
RA20  (via drill 0.35)
  Top 0.2: U2.21 9.6,49.11 11.49,47.22 v11.49,46.01 | v19.11,40.93 19.23,40.93 19.77,40.39 19.77,36.6 20.82,35.55 20.82,33.86 v20.43,33.46 | 44.75,12.88 43.95,13.68 43.95,17.29 44.26,17.59 44.26,18.43 43.3,19.39 43.3,26.76 45.6,29.06 v45.6,29.48
  Top 0.203: U1.46 44.75,12.88
  Bottom 0.2: v11.49,46.01 11.69,45.81 11.69,44.64 14.86,41.48 18.57,41.48 v19.11,40.93 | v20.43,33.46 20.12,33.16 20.12,32.46 21.68,30.9 22.83,30.9 23.93,29.8 24.48,29.8 26.17,28.11 32.41,28.11 32.9,28.59 38.78,28.59 40.42,30.24 41.2,30.24 41.58,29.85 45.22,29.85 v45.6,29.48
RA21  (via drill 0.35)
  Top 0.2: U2.22 8.8,49.11 10.84,47.07 10.84,45.35 v11.03,45.16 | v22.18,33.72 21.88,34.02 21.88,35.99 20.83,37.04 20.83,38.6 v21.16,38.93 | v46.12,31.01 46.12,30.92 45.33,30.13 45.32,30.13 44.93,29.74 44.93,28.89 42.95,26.91 42.95,19.24 43.91,18.28 43.91,17.74 43.6,17.43 43.6,13.51 44.25,12.86
  Top 0.203: U1.45 44.25,12.86 | 44.25,12.86 | 44.25,12.86
  Bottom 0.2: v11.03,45.16 11.03,44.76 14.66,41.12 17.99,41.12 18.84,40.27 19.39,40.27 20.73,38.93 v21.16,38.93 | v22.18,33.72 22.18,33.31 22.33,33.15 22.33,32.89 24.37,30.86 24.91,30.86 26.61,29.16 31.98,29.16 32.46,29.65 38.34,29.65 39.99,31.29 43.66,31.29 43.98,31.62 45.51,31.62 v46.12,31.01
RAM_/CS  (via drill 0.35)
  Top 0.2: v16.59,45.75 15.52,46.81 U2.14 13.55,46.81 13.3,47.06 13.3,48.91 v13.85,49.46 | 18.81,44.1 18.81,44.11 | 18.81,44.11 18.81,46.93 v18.69,47.05 21.09,47.05 21.86,47.83 U4.7 | 18.81,44.11 20,42.92 20,42.45 21.27,41.17 Q2.2 | v11.44,51.41 10.85,52 U5.5
  Bottom 0.2: v18.69,47.05 18.64,47.05 17.34,45.75 v16.59,45.75 | v13.85,49.46 13.64,49.46 11.69,51.41 v11.44,51.41
RAM_/CS_G  (via drill 0.35)
  Top 0.2: C11.1 21.78,21.11 20.23,19.56 20.23,19.57 U3.22 18.82,19.57 18.08,20.31 18.08,26.85 16.82,28.11 16.82,29.43 16.7,29.55 16.7,37.56 v17,37.86 | v22.47,46.55 22.52,46.49 22.52,42.14 22.23,41.85 Q2.3 | Q2.3 22.23,38.3 21.51,37.58 v21.51,37.33 21.51,36.88 22.77,35.61 SJ3.2 23.5,35.87 | v22.64,52.74 23.15,52.23 R7.1 | Q2.3 22.62,38.11
  Top 0.203: U5.6 16.41,52.61 v16.5,52.52
  Bottom 0.2: v17,37.86 17.75,38.61 20.05,38.61 21.33,37.33 v21.51,37.33 | v22.47,46.55 v22.46,46.55 21.87,47.14 21.87,47.98 23.09,49.2 23.09,52.28 v22.64,52.74
  Bottom 0.203: v22.64,52.74 20.11,52.74 19.87,52.5 16.52,52.5 v16.5,52.52
SND  (via drill 0.35)
  Top 0.2: 47.25,10.98 P1.31 | 43.75,11.16 44.1,10.81 v45.4,10.81
  Top 0.203: R8.2 v47.5,11.11 47.38,11.11 47.25,10.98 | 43.75,11.16 U1.44
  Bottom 0.2: v47.5,11.11 47.2,10.81 v45.4,10.81
SRAM_SEL1  (via drill 0.35)
  Top 0.178: SJ1.2 9.4,37.91 9.4,37.24 v9.2,37.04 | v12.52,37.51 12.55,37.49 12.55,33.76
  Top 0.2: U3.28 18.24,27.19 17.17,28.26 17.17,29.65 v17.35,29.82
  Top 0.203: SJ1.2 9.85,38.91 | 12.55,33.76 v12.55,29.46
  Bottom 0.178: v9.2,37.04 9.22,37.02 9.72,37.02 10.22,37.51 v12.52,37.51
  Bottom 0.2: v17.35,29.82 16.65,29.12 12.89,29.12 v12.55,29.46
SRAM_SEL2
  Top 0.2: SJ2.2 9.53,34.34 9.53,30.21 9.04,29.73 U3.3 U3.L3
VBAT  (via drill 0.35)
  Top 0.203: v16.49,55.36 16.2,55.07 16.14,55.07 15.68,54.61 U5.10
  Top 0.4: R1.1 21.4,53.86 | R1.1 21.5,53.81 | U4.4 24.41,44.38 25.09,45.07 25.09,48.07 v25.29,48.27 | 21.45,54.22 R1.1 | R1.1 21.33,53.98 v21.33,54.96
  Bottom 0.203: v16.49,55.36 15.75,55.36 TP2.TP
  Bottom 0.4: v25.29,48.27 25.29,48.62 23.9,50.01 23.9,53.06 22.65,54.31 21.35,54.31 | v16.49,55.36 16.59,55.36 17.65,54.31 21.35,54.31 | v21.33,54.96 21.35,54.95 21.35,54.31
  pour Top: 14.5,54.51 14.5,55.91 16.85,55.91 16.85,54.51
VCC  (via drill 0.35)
  Top 0.203: 47.29,15.96 R8.1 46.48,15.96 45.77,15.25 v45.27,15.25 | 40.25,14.19 v41.3,15.24 | v26.5,55.11 29.5,55.11 | 2,7.61 v2,9.11 | 46,33.21 45.5,33.71 v45.5,35.21
  Top 0.4: 26.76,60.05 26.7,60.11 | C1.1 47.5,32.21 46.5,33.21 46,33.21 41.9,33.21 41.5,33.61
  Top 0.5: v2,9.11 1,10.11 | 1,59.11 2,60.11 26.7,60.11 42,60.11 46,56.11 49,56.11 50,55.11 50,44.81
  Top 1.5: P1.1 2,7.61
  Bottom 0.203: v41.3,15.24 v45.27,15.24 v45.27,15.25 | TP5.TP v26.5,55.11
  other vias: 2,10.61 0.82,12.54 0.82,14.54 0.82,20.48 0.82,24.59 0.82,28.48 0.82,32.48 0.82,36.48 0.82,40.48 0.82,44.48 0.82,17.29 44.8,35.88 47.23,40.71 48,40.21 0.82,42.48 0.82,11.54 0.82,13.54 0.82,18.29
  pour Top (rank 2): 2.65,2.76 2.65,7.56 5.2,7.56 5.2,13.26 3.7,14.76 3.7,18.06 3.2,18.56 3.2,20.81 4.5,22.11 4.5,47.11 5,47.61 5,48.86 7.25,48.86 7.25,53.01 8.35,54.11 28.2,54.11 28.2,58.81 41.65,58.81 45.55,54.91 47.65,54.91 47.65,43.66 51.4,43.66 51.4,63.01 51.5,63.11 51.5,63.61 -1.5,63.61 -1.5,2.61 2.5,2.61
  pour Top (rank 2): 39.2,31.71 39.2,34.01 40.65,34.01 40.65,26.91 42.2,25.36 42.2,15.31 41.2,14.31 41.2,11.41 40.1,11.41 40.1,17.31 38.7,18.71 38.7,31.21
  pour Top (rank 2): 18.1,54.51 20.65,54.51 20.65,47.01 18.1,47.01
  pour Top (rank 3): 27.6,44.21 arc-90 37.6,54.21 arc-90 47.5,44.31 47.5,43.56 48.5,43.56 48.5,54.21 arc90 47,55.71 46,55.71 arc-90 44.5,57.21 arc90 43,58.71 27.4,58.71 27.4,39.51
  pour Top (rank 3): 47.5,44.06 arc-90 37.55,34.11 37.55,32.36 46,32.36 46,37.51 51.45,37.51 51.45,44.06
  pour Bottom: -0.5,8.61 2.5,8.61 2.5,11.11 1.73,11.11 1.73,45.11 -0.5,45.11
  pour Bottom: 44.5,34.91 44.5,38.38 47.12,41.01 48.33,41.01 48.33,40.09 45.83,37.59 45.83,34.91
VCC_SRAM  (via drill 0.35)
  Top 0.203: SJ2.1 8.4,34.66 8.8,34.26 8.8,33.36 v8.85,33.31 | v18.76,35.25 19.33,34.69 U3.32 20.09,32.27 | U3.30 20.88,29.73 | U4.6 23.1,48.89 23.1,50.31 | R7.2 21.4,51.63 v21.4,50.31
  Bottom 0.203: v8.85,33.31 10.72,33.31 12.97,35.56 18.46,35.56 v18.76,35.25 | TP1.TP 10,54.61
  other vias: 22.4,50.31 11.35,55.61 12.55,55.61 13.75,55.61 13.75,54.61 23.8,47.31 23.8,46.31 25.9,46.31 25.9,47.31
  pour Top (rank 3): 24.5,41.26 23.7,41.26 23.6,41.16 22.45,41.16 22.45,40.21 22.43,38.41 22.98,38.41 22.98,35.56 17.85,35.56 17.85,33.46 17.25,32.86 17.25,27.86 23.8,27.86 23.8,32.28 24.5,32.28
  pour Top: 21.05,53.06 27.6,53.06 27.6,32.26 21.9,32.26 20.4,37.36 22.42,39.38 22.4,47.26 21.05,48.61
  pour Bottom: 9.9,56.16 9.9,54.06 13.1,54.06 13.1,53.06 14.75,51.41 21.05,51.41 21.05,49.91 23.1,49.91 23.1,53.21 23,53.31 17.55,53.31 16.8,54.06 16.8,55.31 15.5,55.31 15.5,56.16
  pour Top: 10.85,54.61 10.85,55.91 14.05,55.91 14.05,53.66 12.85,53.66 11.9,54.61
  pour Bottom: 23.5,46.01 26.2,46.01 26.2,47.61 23.5,47.61

### Text on the board
tPlace: 256K / /1M | 64K | SW1
tNames: + | MBC5 | CR2032 | U4 | - | CR2025 | EEPROM | SRAM | 29F016 / 29F032 / 29F033 | 1008 / 62256 / 6264
tStop: GAME BOY MBC5 CARTRIDGE | 1 | 32
bStop: v1.3 | SUPPORT ORIGINAL CREATORS! | www.mousebitelabs.com